# EAGLE design battery_09_26_2017 (EAGLE 6.6.0)
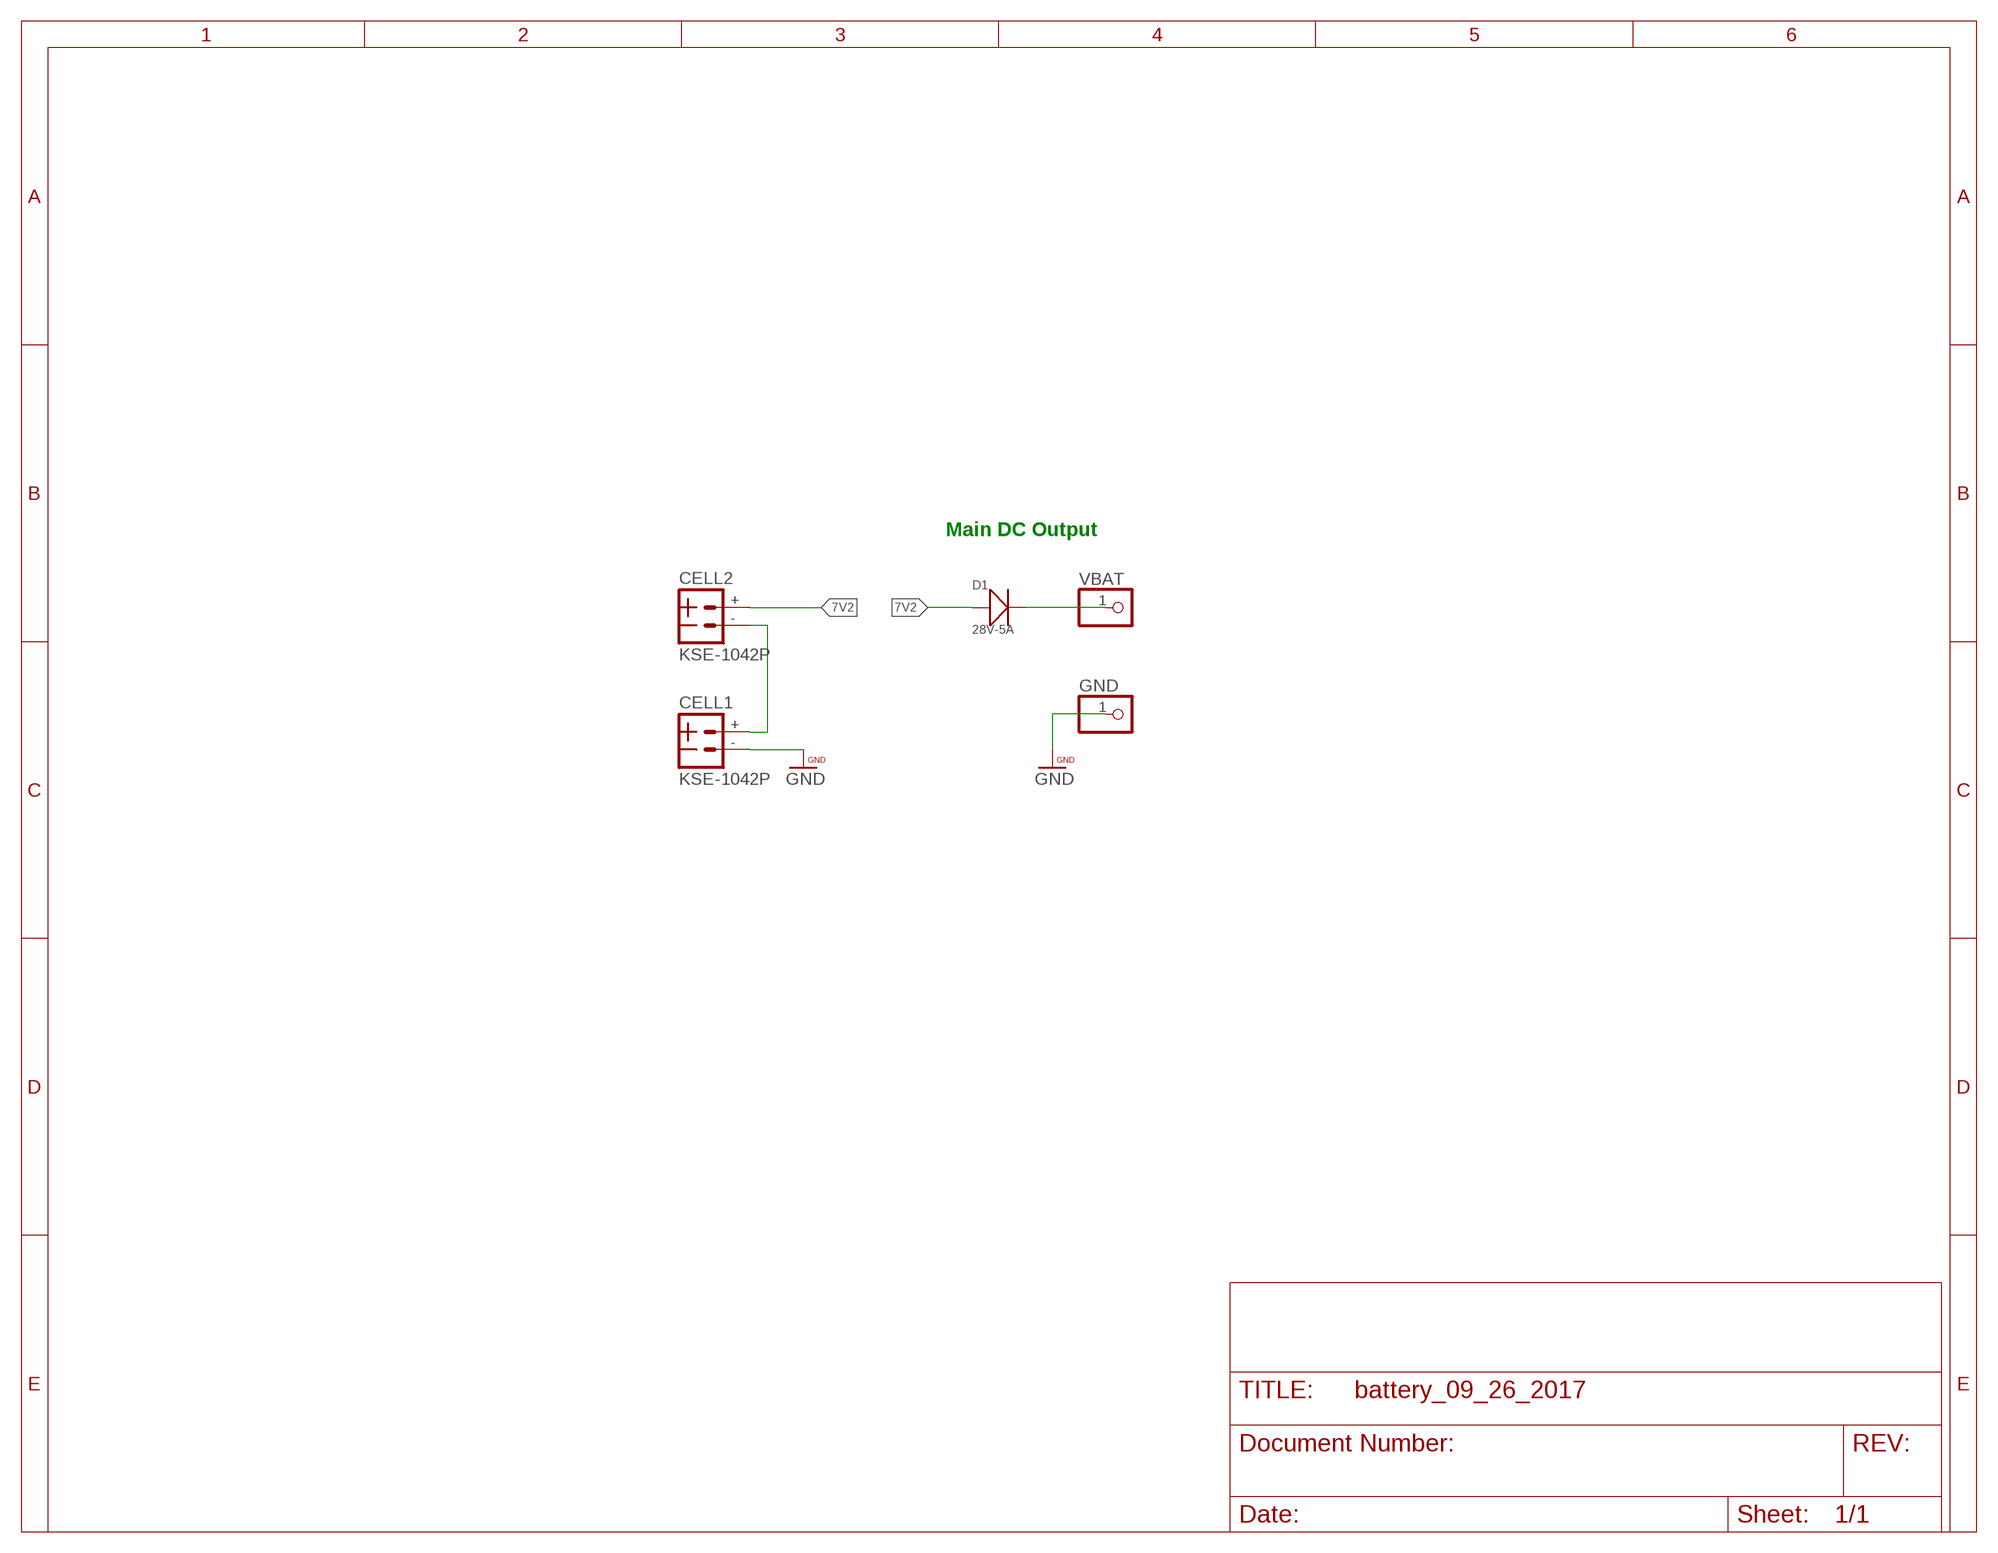
[diagram p0: schematic, sheet 1]

## Parts
CELL1  KSE-1042P  [KSE-1042P]
CELL2  KSE-1042P  [KSE-1042P]
D1  28V-5A  SMD-DIODE-SCHOTTKY-28V-5A(DO-214AA)  [DO-214AA]
GND  WPAD-1-PTH  [WPAD-1-PTH-2.54]
VBAT  WPAD-1-PTH  [WPAD-1-PTH-2.54]

## Nets
7V2: CELL2.+ D1.+
CELL1: CELL1.+ CELL2.-
GND: CELL1.- GND.1
VBAT: D1.- VBAT.1

## Notes on the sheet
- Main DC Output

## Library data of the parts
CELL1 CELL2 = nsvr:KSE-1042P
D1 = Seeed-Diode-2016:SMD-DIODE-SCHOTTKY-28V-5A(DO-214AA): 304020021; MPN: SS54B
GND VBAT = PatternAgents-ProtoPads:WPAD-1: Wire Pad - Single Good for scope lead clips, test jumpers, probe points, etc. PatternAgents ProtoPads Library Schematic and PCB layout libraries for design patterns by PatternAgents. For the CADSoft Eagle CAD program : http://www.cadsoftusa.com/download-eagle/ Source LBR : http://www.patternagents.com Github : https://github.com/PatternAgents License : http://creativecommons.org/licenses/by-sa/4.0/ (Creative Commons 4.0) THIS SOFTWARE IS PROVIDED BY THE CONTRIBUTORS "AS IS" AND WITHOUT ANY EXPRESS OR IMPLIED WARRANTIES, INCLUDING, BUT NOT LIMITED TO, THE IMPLIED WARRANTIES OF MERCHANTABILITY AND FITNESS FOR A PARTICULAR PURPOSE ARE DISCLAIMED. IN NO EVENT SHALL THE COPYRIGHT OWNER OR CONTRIBUTORS BE LIABLE FOR ANY DIRECT, INDIRECT, INCIDENTAL, SPECIAL, EXEMPLARY, OR CONSEQUENTIAL DAMAGES (INCLUDING, BUT NOT LIMITED TO, PROCUREMENT OF SUBSTITUTE GOODS OR SERVICES; LOSS OF USE, DATA, OR PROFITS; OR BUSINESS INTERRUPTION) HOWEVER CAUSED AND ON ANY THEORY OF LIABILITY, WHETHER IN CONTRACT, STRICT LIABILITY, OR TORT (INCLUDING NEGLIGENCE OR OTHERWISE) ARISING IN ANY WAY OUT OF THE USE OF THIS SOFTWARE, EVEN IF ADVISED OF THE POSSIBILITY OF SUCH DAMAGE.; BOM: EXCLUDE

## Board
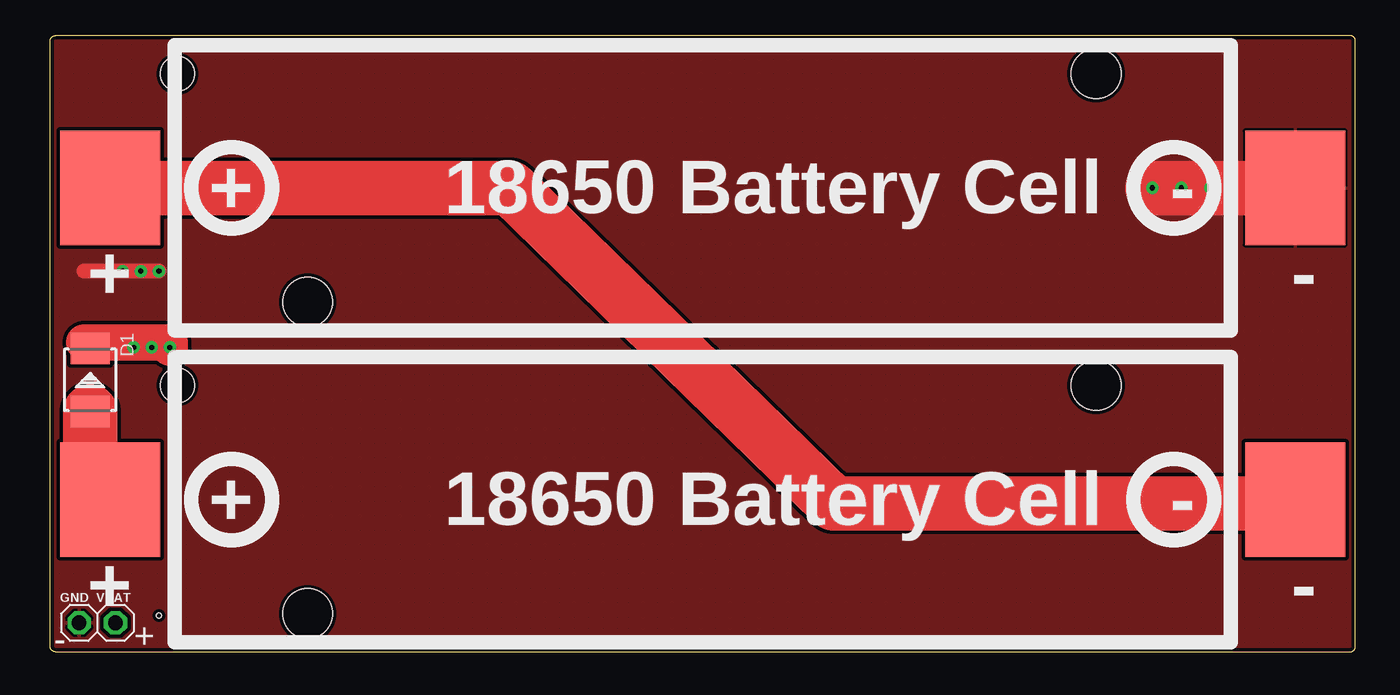
[diagram p1: board, top side]
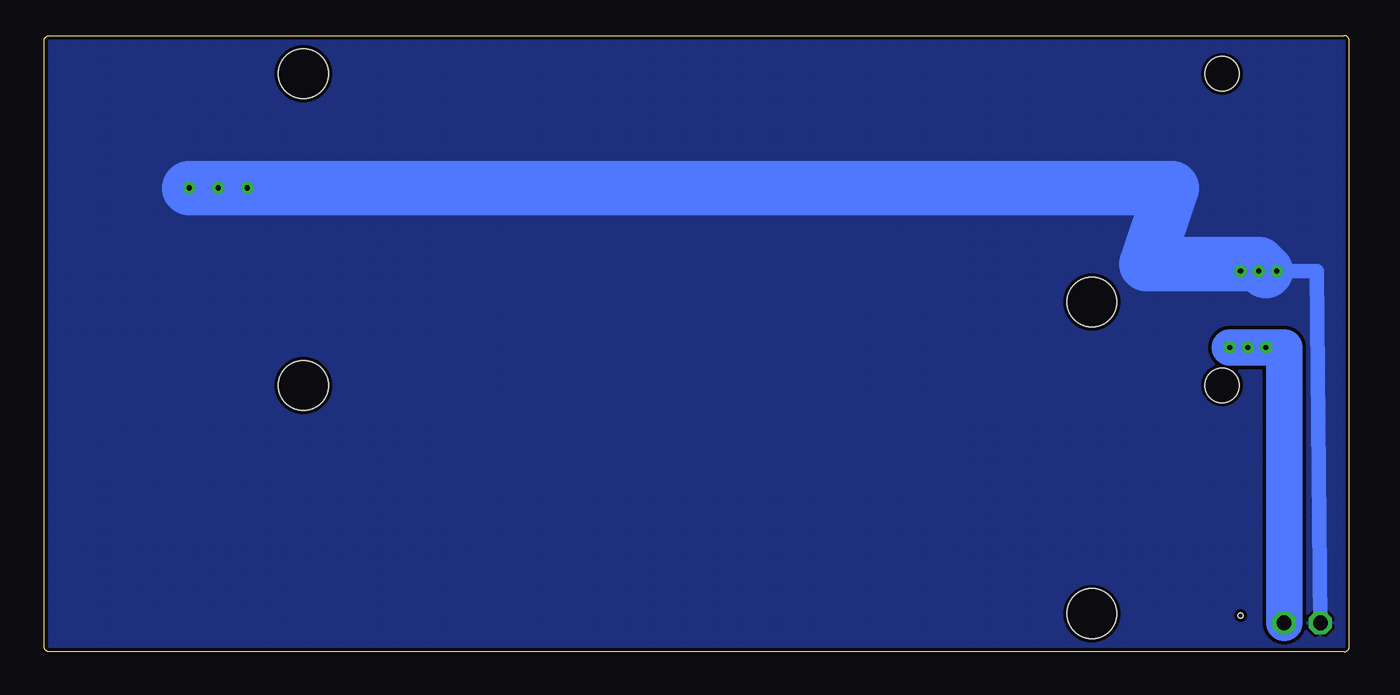
[diagram p2: board, bottom side, seen from below]

Size 91.44 x 43.18 mm. Coordinates in mm from the lower left corner, seen from the top.
Outline: 0.36,0 91.08,0 arc90 91.44,0.36 91.44,42.82 arc90 91.08,43.18 0.36,43.18 arc90 0,42.82 0,0.36 arc90 0.36,0
Copper layers (1*16): Top 0.035mm / dielectric 1.5mm / Bottom 0.035mm
Design rules "PatternAgents_7mil": minimum track width 7mil, minimum drill 14mil, track to track 7mil, track to pad 7mil, pad to pad 7mil, via to via 7mil, smd to smd 7mil, copper to edge 7mil, drill to drill 7mil, minimum pad ring 12mil, minimum via ring 10mil, stop-mask expansion 4mil, vias tented up to drill 25mil, thermal gap 7mil
Holes 0.36 mm at 7.62,2.54

### Footprints (pad centres in the part's own frame; a part is rotated, then mirrored left to right if it is on the bottom)
KSE-1042P = smd 7 x 8: + 41.5,0; - -41.5,0 | hole 3.5: -27.559,-8; 27.686,8 | hole 2.4: 36.8,-8
DO-214AA = smd 2.159 x 2.743: + -2.21,0; - 2.21,0
WPAD-1-PTH-2.54 = drill 1.016 octagon: 1 0,0

### Placement (x,y rotation side)
CELL1  45.72,32.51 180 top
CELL2  45.72,10.67 180 top
D1  2.79,19.05 90 top
GND  2.03,2.03 0 top
VBAT  4.57,2.03 0 top

### Tracks (layer width: path | path; a pad name or v marks a point on that pad's centre or on a via)
7V2
  Top 3.81: D1.+ 2.79,12.36 CELL2.+
CELL1
  Top 3.81: CELL1.+ 32.26,32.51 54.86,10.41 88.22,10.41 CELL2.-
GND  (via drill 0.36)
  Top 1.016: v7.62,26.67 v6.35,26.67 v5.08,26.67 2.36,26.67
  Top 3.81: CELL1.- v81.28,32.51 | v81.28,32.51 v79.25,32.51 v77.22,32.51 v81.28,32.51
  Bottom 1.016: GND.1 2.29,26.67 v5.08,26.67 5.84,26.67 v6.35,26.67 v7.62,26.67
  Bottom 3.81: v81.28,32.51 12.45,32.51 14.22,27.18 6.35,27.18 5.84,26.67
  pour Bottom (isolate 0.254, hatched): 0,0 0,43.18 91.44,43.18 91.44,0
  pour Top (isolate 0.254, hatched): 0,0 0,43.18 91.44,43.18 91.44,0
VBAT  (via drill 0.36)
  Top 0.178: D1.- 2.79,21.68
  Top 2.54: 2.38,21.68 2.79,21.68 8.38,21.68 v8.38,21.34
  Bottom 2.54: VBAT.1 4.57,21.34 v5.84,21.34 v7.11,21.34 v8.38,21.34

### Text on the board
tPlace: - | +